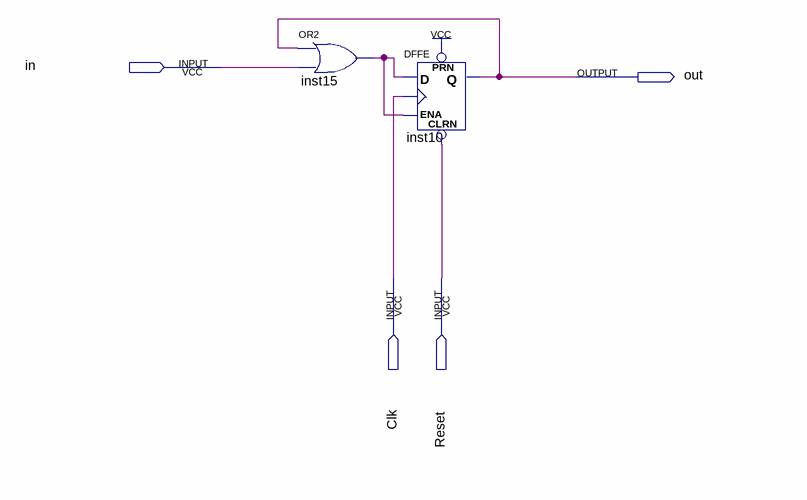
[diagram p0: schematic sheet]
// Quartus schematic FlipFlopMemory1.bdf as structural Verilog: 2 symbols, 4 pins
module FlipFlopMemory1 (
  input  in,
  input  Clk,
  input  Reset,
  output out
);

  wire inst15_out;

  or inst15 (inst15_out, out, in);
  DFFE inst10 (.PRN(1'b1), .CLRN(Reset), .D(inst15_out), .CLK(Clk), .ENA(inst15_out), .Q(out));
endmodule
